# EasyEDA Pro project devboard.epro, board Cartridge_ESP8285
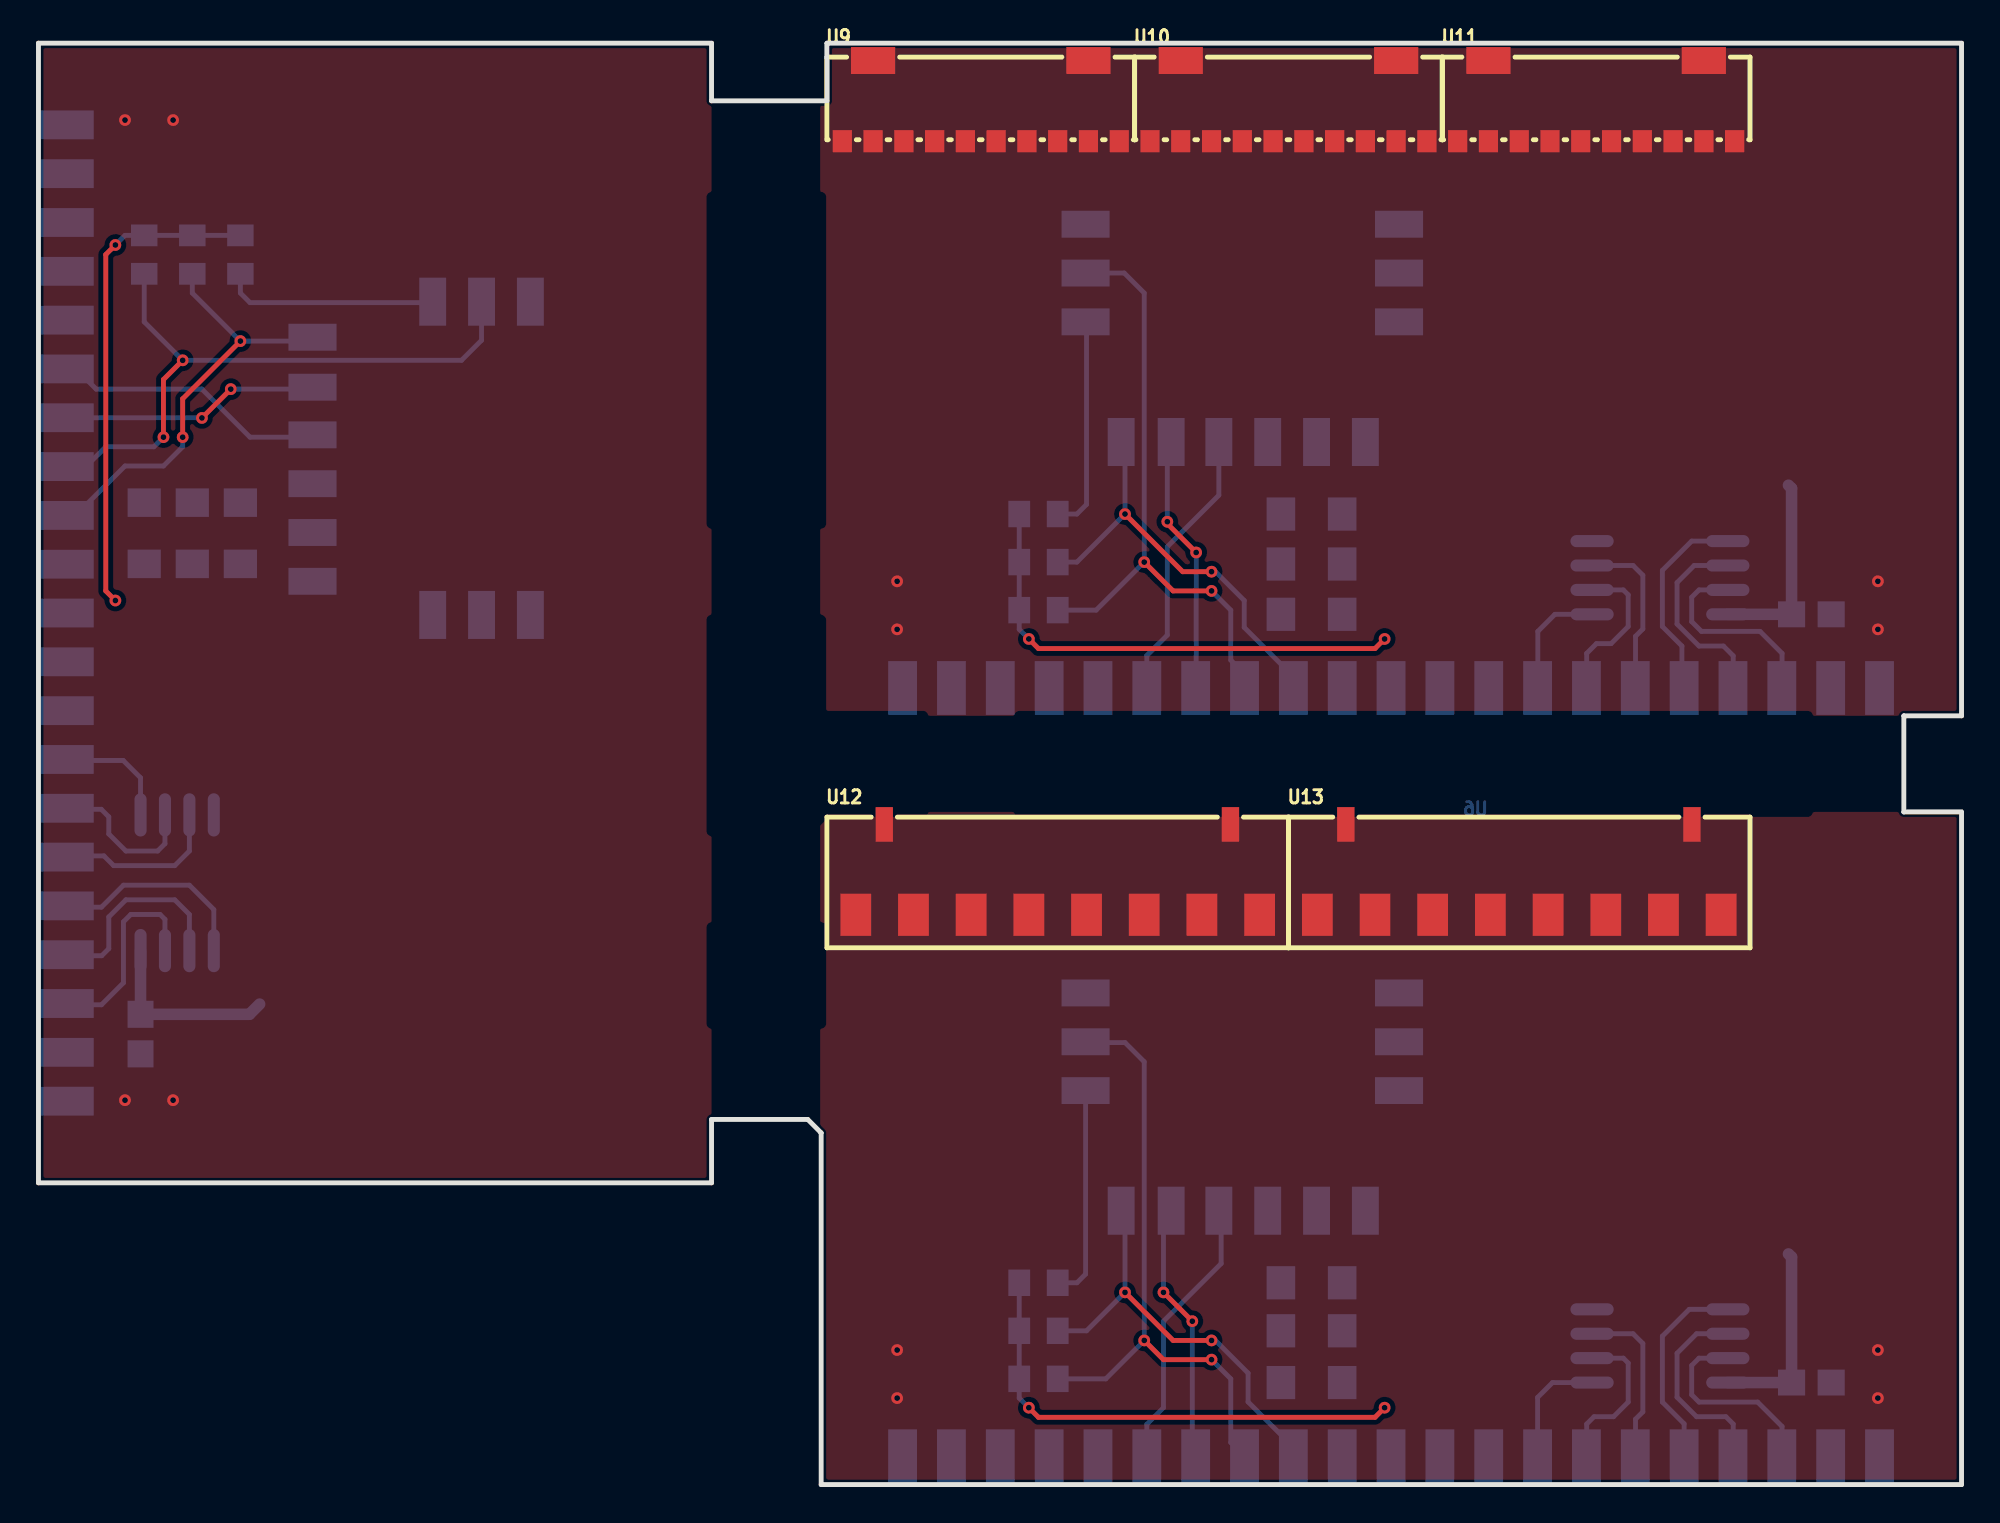
[diagram p21: board, top side]
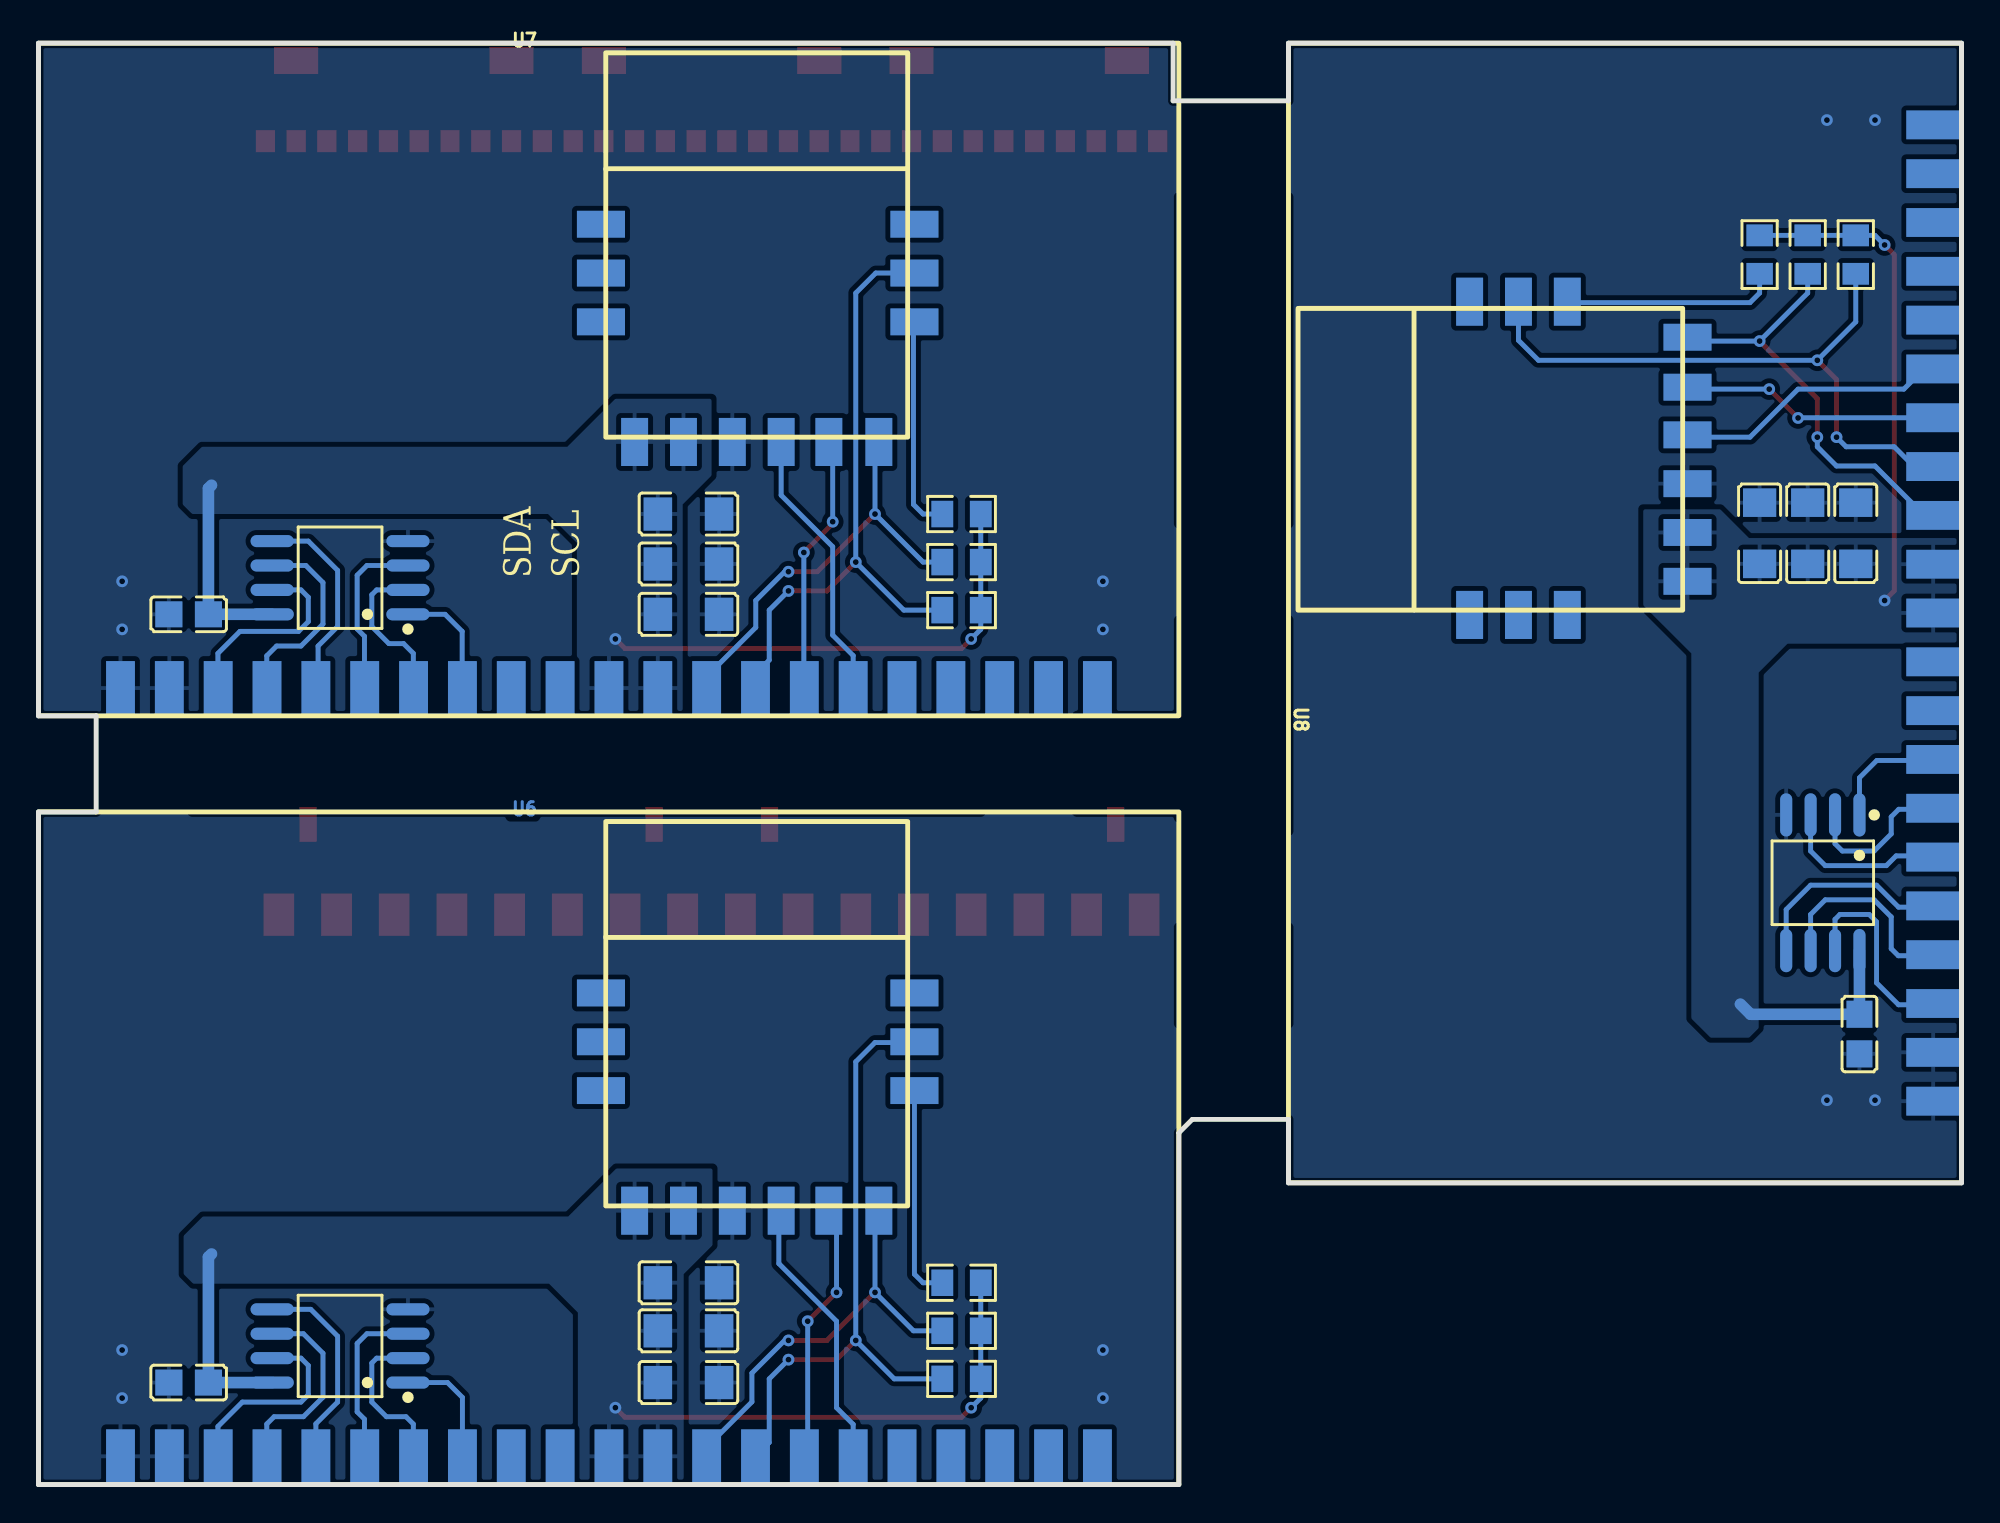
[diagram p22: board, bottom side, seen from below]

Outline 100 x 75 mm; copper layers: Top Layer, Bottom Layer. Coordinates in mm from the lower left corner of the outline.
Outline path: 0,75 35,75 35,72 41,72 41,75 100,75 100,40 97,40 97,35 100,35 100,0 40.7,0 40.7,18.3 40,19 35,19 35,15.7 0,15.7 0,75
Stack: Top Layer 0.035mm / Dielectric1 1.51mm FR4 er 4.5 / Bottom Layer 0.035mm

## Design rules (mm)
template: JLCPCB Capability(Two Layers Board)
spacing copperThickness1oz (default): track to track 0.102, other pairs 0.152 to 0.3
spacing copperThickness2oz: track to track 0.203, other pairs 0.152 to 0.3
track width copperThickness1oz (default): min 0.127, default 0.254, max 2.54
track width copperThickness2oz: min 0.203, default 0.254, max 2.54
differential pair differentialPair (default): width min 0.127, default 0.254, max 2.54; gap min 0.152, default 0.152
via viaSize (default): diameter min 0.5, default 0.61, max 10; hole min 0.3, default 0.305, max 6.3

## Placement (name value [footprint] x y rotation side)
C5  100nF  [C0805]  92.19 5.31 180 bottom
C6  100uF  [C1206]  66.2 5.31 0 bottom
C7  100nF  [C0805]  92.19 45.28 180 bottom
C8  100uF  [C1206]  66.2 45.28 0 bottom
C9  100nF  [C0805]  5.31 23.44 90 bottom
C10  100uF  [C1206]  5.5 49.5 270 bottom
C11  100uF  [C1206]  66.2 8 0 bottom
C12  100uF  [C1206]  66.2 10.5 0 bottom
C13  100uF  [C1206]  66.2 47.9 0 bottom
C14  100uF  [C1206]  66.2 50.5 0 bottom
C15  100uF  [C1206]  10.5 49.5 270 bottom
C16  100uF  [C1206]  8 49.5 270 bottom
CONN1  -  [RCKid Cartridge Pins]  70.33 1.47 0 bottom
CONN2  -  [RCKid Cartridge Pins]  70.34 41.45 0 bottom
CONN3  -  [RCKid Cartridge Pins]  1.47 45.35 270 bottom
R3  10K  [R0805]  52 5.5 180 bottom
R4  10K  [R0805]  52 8 180 bottom
R5  10K  [R0805]  52 10.5 180 bottom
R6  10K  [R0805]  52 45.5 180 bottom
R7  10K  [R0805]  52 48 180 bottom
R8  10K  [R0805]  52 50.5 180 bottom
R9  10K  [R0805]  5.5 64 90 bottom
R10  10K  [R0805]  8 64 90 bottom
R11  10K  [R0805]  10.5 64 90 bottom
U3  W25Q128JVSIQTR -YJLTY  [SOIC-8_L5.3-W5.3-P1.27-LS8.0-BL]  84.32 7.21 90 bottom
U4  W25Q128JVSIQTR -YJLTY  [SOIC-8_L5.3-W5.3-P1.27-LS8.0-BL]  84.32 47.19 90 bottom
U5  W25Q128JVSIQTR -YJLTY  [SOIC-8_L5.3-W5.3-P1.27-LS8.0-BL]  7.21 31.32 0 bottom
U6  -  [ESP-M3]  70.5 14.5 180 bottom
U7  -  [ESP-M3]  70.5 54.5 180 bottom
U8  -  [ESP-M3]  14.5 45.5 90 bottom
U9  GT-BTP16010-0180B-014B  [CONN-SMD_GT-BTP16010-0180B-014B]  49 72 0 top
U10  GT-BTP16010-0180B-014B  [CONN-SMD_GT-BTP16010-0180B-014B]  65 72 0 top
U11  GT-BTP16010-0180B-014B  [CONN-SMD_GT-BTP16010-0180B-014B]  81 72 0 top
U12  GT-BTP30008-0240B-019A  [SMD_GT-BTP30008-0240B-019A]  53 32 0 top
U13  GT-BTP30008-0240B-019A  [SMD_GT-BTP30008-0240B-019A]  77 32 0 top

## Footprints (pads in the part's own frame, mm; a bottom-side part is the same pattern mirrored in y, then rotated)
C0805
  rect 1.41x1.35 smd: 1(-1.03,0) 2(1.03,0)
C1206
  rect 1.485x1.728 smd: 1(-1.593,0) 2(1.593,0)
CONN-SMD_GT-BTP16010-0180B-014B
  rect 1x1.15 smd: 1(-7.2,-2.098) 2(-5.6,-2.098) 3(-4,-2.098) 4(-2.4,-2.098) 5(-0.8,-2.098) 6(0.8,-2.098) 7(2.4,-2.098) 8(4,-2.098) 9(5.6,-2.098) 10(7.2,-2.098)
  rect 2.3x1.4 smd: 11(5.6,2.098) 12(-5.6,2.098)
ESP-M3
  rect 2.5x1.4 smd: 1(-0.25,11.08) 2(-0.25,8.54) 3(-0.25,6) 10(16.05,6) 11(16.05,8.54) 12(16.05,11.08)
  rect 1.4x2.5 smd: 4(1.5,-0.25) 5(4.04,-0.25) 6(6.58,-0.25) 7(9.12,-0.25) 8(11.6,-0.25) 9(14.2,-0.25)
R0805
  rect 1.133x1.377 smd: 1(-1,0) 2(1,0)
RCKid Cartridge Pins
  rect 1.5x2.8 smd: 1(-25.4,0) 2(-22.86,0) 3(-20.32,0) 4(-17.78,0) 5(-15.24,0) 6(-12.7,0) 7(-10.16,0) 8(-7.62,0) 9(-5.08,0) 10(-2.54,0) 11(0,0) 12(2.54,0) 13(5.08,0) 14(7.62,0) 15(10.16,0) 16(12.7,0) 17(15.24,0) 18(17.78,0) 19(20.32,0) 20(22.86,0) 21(25.4,0)
SMD_GT-BTP30008-0240B-019A
  rect 1.6x2.2 smd: 1(-10.5,-2.349) 2(-7.5,-2.349) 3(-4.5,-2.349) 4(-1.5,-2.349) 5(1.5,-2.349) 6(4.5,-2.349) 7(7.5,-2.349) 8(10.5,-2.349)
  rect 0.9x1.8 smd: 9(8.983,2.349) 10(-9.017,2.349)
SOIC-8_L5.3-W5.3-P1.27-LS8.0-BL
  oval 0.63x2.25 smd: 1(-1.905,-3.53) 2(-0.635,-3.53) 3(0.635,-3.53) 4(1.905,-3.53) 5(1.905,3.53) 6(0.635,3.53) 7(-0.635,3.53) 8(-1.905,3.53)

## Nets
As in the schematic.

Pads without a net: CONN1 1 2 3 4 5 12 13; CONN2 1 2 3 4 5 12 13; CONN3 1 2 3 4 5 12 13; U6 1 2 3 12; U7 1 2 3 12; U8 1 2 3 12; U9 1 2 3 4 5 6 7 8 9 10 11 12; U10 1 2 3 4 5 6 7 8 9 10 11 12; U11 1 2 3 4 5 6 7 8 9 10 11 12; U12 1 2 3 4 5 6 7 8 9 10; U13 1 2 3 4 5 6 7 8 9 10

## Via types
v1: diameter 0.61, hole 0.305, Top Layer to Bottom Layer, 36 vias

## Routing (per net, layer and track width the routed paths; a pad name or vN(x,y) marks a point on that pad's centre or on a via; arc(x,y) is an arc through that point)
3V3: length 106.8
  Top Layer w0.254: v1(4,64.5) 3.5,64 3.5,46.5 v1(4,46) ; v1(70,4) 69.5,3.5 52,3.5 v1(51.5,4) ; v1(70,44) 69.5,43.5 52,43.5 v1(51.5,44)
  Bottom Layer w0.254: R5.2 R4.2 R3.2 51,4.5 v1(51.5,4) ; R8.2 R7.2 R6.2 51,44.5 v1(51.5,44) ; R11.2 R10.2 R9.2 4.5,65 v1(4,64.5)
  Bottom Layer w0.6: 11.5,25 10.97,24.47 C9.2 U5.8 ; 91,12 91.16,11.84 C5.2 U3.8 ; U4.8 C7.2 91.16,51.84 91,52
GND:
  vias: v1(4.5,71) v1(4.5,20) v1(7,71) v1(7,20) v1(44.65,47) v1(44.65,44.5) v1(44.65,7) v1(44.65,4.5) v1(95.65,47) v1(95.65,44.5) v1(95.65,7) v1(95.65,4.5)
ESP_FLASH: length 99.6
  Top Layer w0.254: v1(7.5,58.5) 6.5,57.5 v1(6.5,54.5) ; v1(61,6.5) 58.5,6.5 v1(57.5,7.5) ; v1(57.5,48) 59,46.5 v1(61,46.5)
  Bottom Layer w0.254: CONN1.8 62,2.19 62,5.5 v1(61,6.5) ; v1(61,46.5) 62,45.5 62,42.9 62.72,42.19 CONN2.8 62.72,41.79 ; 23.04,61.55 23.04,59.54 22,58.5 v1(7.5,58.5) 5.5,60.5 R9.1 ; v1(6.5,54.5) 6,54 3.5,54 2.47,52.97 CONN3.8 ; U7.11 56.46,63.04 57.5,62 v1(57.5,48) 55,45.5 R6.1 ; U6.11 54.49,23 56.5,23 57.5,22 v1(57.5,7.5) 55.5,5.5 R3.1
ESP_RESET: length 67.2
  Top Layer w0.254: v1(56.5,10) 59,7.5 v1(61,7.5) ; v1(56.5,50.5) 59.5,47.5 v1(61,47.5) ; v1(7.5,54.5) 7.5,56.5 v1(10.5,59.5)
  Bottom Layer w0.254: R4.1 54.5,8 v1(56.5,10) 56.5,14.05 U6.9 ; 56.5,54 v1(56.5,50.5) 54,48 R7.1 ; v1(61,7.5) 61.2,7.5 62.9,5.8 62.9,4.3 64.8,2.4 65,2.4 65.25,2.15 CONN1.9 ; CONN3.9 1.93,50.43 4.5,53 6.5,53 7.5,54 v1(7.5,54.5) ; R10.1 8,62 v1(10.5,59.5) 15,59.5 ; CONN2.9 65.25,42.05 62.7,44.6 62.7,46 61.2,47.5 v1(61,47.5)
ESP_RXD: length 40.6
  Top Layer w0.254: v1(60,8.5) v1(58.5,10) ; v1(58.7,50.1) 58.7,50 v1(60.2,48.5) ; v1(10,57) v1(8.5,55.5)
  Bottom Layer w0.254: v1(60.2,48.5) 60.2,41.47 CONN2.7 ; U6.8 58.5,13.85 v1(58.5,10) ; CONN1.7 60,1.65 v1(60,8.5) ; v1(8.5,55.5) 8.49,55.51 CONN3.7 ; U7.8 58.7,54.05 v1(58.7,50.1) ; v1(10,57) 14.15,57 U8.8
ESP_TXD: length 43.1
  Bottom Layer w0.254: U6.7 61.5,14.13 61.5,11.5 58.5,8.5 58.5,4 57.63,3.13 CONN1.6 ; CONN3.6 1.95,58.05 3,57 8.5,57 11,54.5 14.13,54.5 U8.7 ; U7.7 61.38,51.48 58.7,48.8 58.7,44.2 57.63,43.14 CONN2.6
QSPI_SCLK: length 31.7
  Bottom Layer w0.254: CONN1.18 88.13,1.49 88.13,3.15 87.75,3.53 86.22,3.53 85.21,4.55 85.21,6.83 86.22,7.85 U3.6 ; 1.47,27.52 3.29,27.52 3.66,27.89 3.66,29.54 4.55,30.43 7.09,30.43 7.85,29.66 U5.6 ; U4.6 86.09,47.82 85.21,46.93 85.21,44.77 86.35,43.63 87.62,43.63 88.13,43.12 88.13,41.46 CONN2.18
QSPI_SD0: length 32.1
  Bottom Layer w0.254: U4.5 85.97,49.09 84.44,47.57 84.44,44.65 85.46,43.63 85.46,41.56 CONN2.17 ; CONN1.17 85.57,3.16 84.44,4.29 84.44,7.72 85.84,9.12 U3.5 ; U5.5 9.12,29.92 7.85,31.19 4.42,31.19 3.28,30.05 1.49,30.05 1.47,30.06
QSPI_SD1: length 24.7
  Bottom Layer w0.254: CONN2.15 80.51,41.46 80.51,43.25 81.02,43.76 81.78,43.76 82.67,44.65 82.67,46.3 82.41,46.55 U4.2 ; CONN1.15 80.51,1.49 80.51,3.15 80.89,3.53 81.9,3.53 82.67,4.29 82.67,6.32 82.41,6.58 U3.2 ; 1.47,35.14 3.26,35.14 3.66,34.74 3.66,33.86 4.55,32.97 6.2,32.97 6.58,33.35 U5.2
QSPI_SD2: length 26.6
  Bottom Layer w0.254: U3.3 82.92,7.85 83.43,7.34 83.43,3.78 83.05,3.4 83.05,1.49 CONN1.16 ; U5.3 7.85,32.97 7.09,32.2 3.91,32.2 3.4,32.71 1.59,32.71 1.47,32.6 ; CONN2.16 83.05,41.46 83.05,44.14 83.43,44.52 83.43,47.31 82.92,47.82 U4.3
QSPI_SD3: length 31.6
  Bottom Layer w0.254: CONN2.19 90.67,41.46 90.67,43.25 89.52,44.39 86.48,44.39 85.97,44.9 85.97,46.17 86.35,46.55 U4.7 ; CONN1.19 90.67,1.49 90.67,3.02 89.4,4.29 86.35,4.29 85.97,4.67 85.97,6.2 86.35,6.58 U3.7 ; U5.7 6.58,29.41 6.32,29.66 4.8,29.66 4.42,29.28 4.42,26.11 3.28,24.97 1.49,24.97 1.47,24.98
QSPI_SS: length 18.5
  Bottom Layer w0.254: U4.1 78.86,45.28 77.97,44.39 77.97,41.46 CONN2.14 ; CONN1.14 77.95,4.53 78.73,5.31 U3.1 ; U5.1 5.31,36.78 4.41,37.68 1.47,37.68
$1N1111: length 11.2
  Bottom Layer w0.254: U6.10 54.45,10.95 54,10.5 R5.1
$2N755: length 11.2
  Bottom Layer w0.254: R8.1 54,50.5 54.5,51 54.5,60.45 U7.10
$3N755: length 11.2
  Bottom Layer w0.254: U8.10 20.45,61.5 11,61.5 10.5,62 R11.1

## Copper pours and planes (outline as drawn; the poured copper is in the pictures)
3V3 on Bottom Layer: 0.05,49.25 11.05,49.25 12.55,50.75 16.55,50.75 16.55,45.75 14.05,43.25 14.05,24.25 13.05,23.25 11.05,23.25 10.55,23.75 10.55,42.25 9.05,43.75 0.05,43.75
3V3 on Bottom Layer: 66.5,40 66.5,51 65,52.5 65,56.5 70,56.5 72.5,54 91.5,54 92.5,53 92.5,51 92,50.5 73.5,50.5 72,49 72,40
3V3 on Bottom Layer: 66.45,-0.05 66.45,10.95 64.95,12.45 64.95,16.45 69.95,16.45 72.45,13.95 91.45,13.95 92.45,12.95 92.45,10.95 91.95,10.45 73.45,10.45 71.95,8.95 71.95,-0.05
GND on Top Layer: 40.65,40 40.65,75 99.95,75 99.95,40
GND on Top Layer: 0,75 35,75 35,15.7 0,15.7
GND on Top Layer: 40.65,0 40.65,35 99.95,35 99.95,0
GND on Bottom Layer: 40.7,75 100,75 100,40 40.7,40
GND on Bottom Layer: 0,75 35,75 35,15.7 0,15.7
GND on Bottom Layer: 40.7,35 100,35 100,0 40.7,0

## Text on the board
Bottom Silkscreen Layer: SCL | SDA
